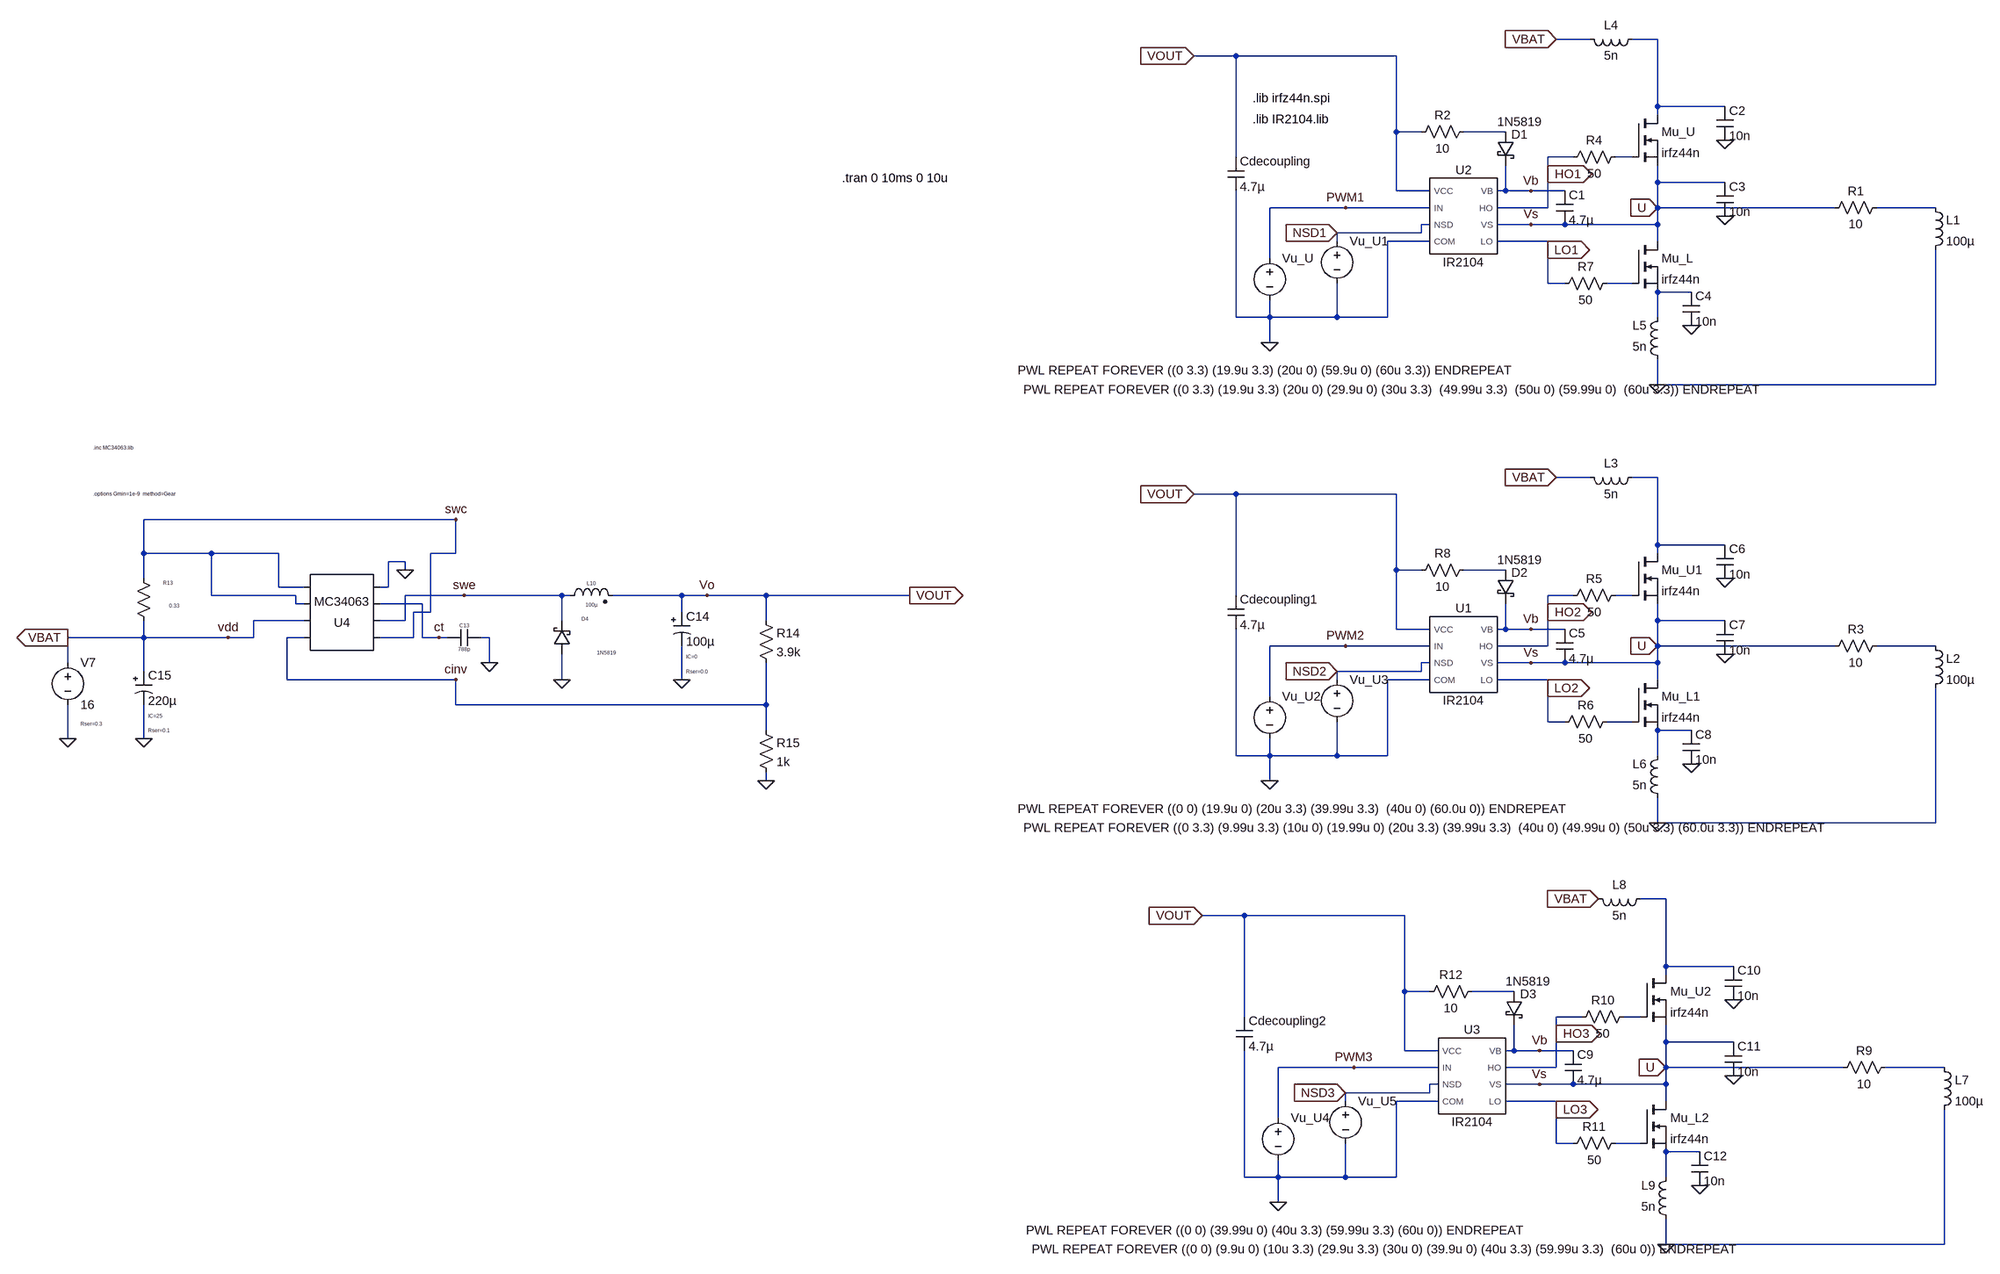
[diagram p0: schematic power_circuitry.asc]
power_circuitry.asc, the LTspice schematic file:
Version 4
SHEET 1 3064 1880
WIRE -336 -480 -400 -480
WIRE -208 -480 -256 -480
WIRE -1008 -448 -1088 -448
WIRE -704 -448 -1008 -448
WIRE -208 -352 -208 -480
WIRE -80 -352 -208 -352
WIRE -208 -336 -208 -352
WIRE -704 -304 -704 -448
WIRE -656 -304 -704 -304
WIRE -496 -304 -576 -304
WIRE -1008 -256 -1008 -448
WIRE -368 -256 -416 -256
WIRE -256 -256 -288 -256
WIRE -416 -224 -416 -256
WIRE -208 -208 -208 -240
WIRE -80 -208 -208 -208
WIRE -704 -192 -704 -304
WIRE -640 -192 -704 -192
WIRE -496 -192 -496 -240
WIRE -496 -192 -512 -192
WIRE -448 -192 -496 -192
WIRE -384 -192 -448 -192
WIRE -800 -160 -944 -160
WIRE -640 -160 -800 -160
WIRE -416 -160 -416 -224
WIRE -416 -160 -512 -160
WIRE -208 -160 -208 -208
WIRE 128 -160 -208 -160
WIRE 320 -160 208 -160
WIRE -640 -128 -656 -128
WIRE -448 -128 -512 -128
WIRE -384 -128 -448 -128
WIRE -208 -128 -208 -160
WIRE -208 -128 -384 -128
WIRE -656 -112 -656 -128
WIRE -656 -112 -816 -112
WIRE -816 -96 -816 -112
WIRE -640 -96 -720 -96
WIRE -416 -96 -512 -96
WIRE -208 -96 -208 -128
WIRE -416 -80 -416 -96
WIRE -944 -64 -944 -160
WIRE -416 -16 -416 -80
WIRE -384 -16 -416 -16
WIRE -256 -16 -304 -16
WIRE -144 0 -208 0
WIRE -1008 48 -1008 -192
WIRE -944 48 -944 16
WIRE -944 48 -1008 48
WIRE -816 48 -816 -16
WIRE -816 48 -944 48
WIRE -720 48 -720 -96
WIRE -720 48 -816 48
WIRE -208 48 -208 0
WIRE -944 96 -944 48
WIRE -208 176 -208 128
WIRE 320 176 320 -80
WIRE 320 176 -208 176
WIRE -336 352 -400 352
WIRE -208 352 -256 352
WIRE -1008 384 -1088 384
WIRE -704 384 -1008 384
WIRE -2720 432 -3312 432
WIRE -208 480 -208 352
WIRE -80 480 -208 480
WIRE -3312 496 -3312 432
WIRE -3184 496 -3312 496
WIRE -3056 496 -3184 496
WIRE -2720 496 -2720 432
WIRE -2720 496 -2768 496
WIRE -208 496 -208 480
WIRE -2816 512 -2848 512
WIRE -2816 528 -2816 512
WIRE -704 528 -704 384
WIRE -656 528 -704 528
WIRE -496 528 -576 528
WIRE -3312 544 -3312 496
WIRE -3056 560 -3056 496
WIRE -3008 560 -3056 560
WIRE -2848 560 -2848 512
WIRE -2848 560 -2864 560
WIRE -3184 576 -3184 496
WIRE -3024 576 -3184 576
WIRE -2704 576 -2816 576
WIRE -2512 576 -2704 576
WIRE -2496 576 -2512 576
WIRE -2256 576 -2416 576
WIRE -2208 576 -2256 576
WIRE -2096 576 -2208 576
WIRE -1824 576 -2096 576
WIRE -1008 576 -1008 384
WIRE -368 576 -416 576
WIRE -256 576 -288 576
WIRE -3024 592 -3024 576
WIRE -3008 592 -3024 592
WIRE -2784 592 -2864 592
WIRE -2768 608 -2768 496
WIRE -2768 608 -2800 608
WIRE -2256 608 -2256 576
WIRE -416 608 -416 576
WIRE -3008 624 -3104 624
WIRE -2816 624 -2816 576
WIRE -2816 624 -2864 624
WIRE -2512 624 -2512 576
WIRE -2096 624 -2096 576
WIRE -208 624 -208 592
WIRE -80 624 -208 624
WIRE -704 640 -704 528
WIRE -640 640 -704 640
WIRE -496 640 -496 592
WIRE -496 640 -512 640
WIRE -448 640 -496 640
WIRE -384 640 -448 640
WIRE -3312 656 -3312 624
WIRE -3312 656 -3456 656
WIRE -3152 656 -3312 656
WIRE -3104 656 -3104 624
WIRE -3104 656 -3152 656
WIRE -3008 656 -3040 656
WIRE -2800 656 -2800 608
WIRE -2800 656 -2864 656
WIRE -2784 656 -2784 592
WIRE -2752 656 -2784 656
WIRE -2736 656 -2752 656
WIRE -2656 656 -2672 656
WIRE -800 672 -944 672
WIRE -640 672 -800 672
WIRE -416 672 -416 608
WIRE -416 672 -512 672
WIRE -208 672 -208 624
WIRE 128 672 -208 672
WIRE 320 672 208 672
WIRE -3456 704 -3456 656
WIRE -2656 704 -2656 656
WIRE -640 704 -656 704
WIRE -448 704 -512 704
WIRE -384 704 -448 704
WIRE -208 704 -208 672
WIRE -208 704 -384 704
WIRE -3312 720 -3312 656
WIRE -656 720 -656 704
WIRE -656 720 -816 720
WIRE -3040 736 -3040 656
WIRE -2720 736 -3040 736
WIRE -2512 736 -2512 688
WIRE -2256 736 -2256 672
WIRE -816 736 -816 720
WIRE -640 736 -720 736
WIRE -416 736 -512 736
WIRE -208 736 -208 704
WIRE -416 752 -416 736
WIRE -944 768 -944 672
WIRE -2720 784 -2720 736
WIRE -2096 784 -2096 704
WIRE -2096 784 -2720 784
WIRE -416 816 -416 752
WIRE -384 816 -416 816
WIRE -256 816 -304 816
WIRE -2096 832 -2096 784
WIRE -144 832 -208 832
WIRE -3456 848 -3456 784
WIRE -3312 848 -3312 784
WIRE -1008 880 -1008 640
WIRE -944 880 -944 848
WIRE -944 880 -1008 880
WIRE -816 880 -816 816
WIRE -816 880 -944 880
WIRE -720 880 -720 736
WIRE -720 880 -816 880
WIRE -208 880 -208 832
WIRE -2096 928 -2096 912
WIRE -944 928 -944 880
WIRE -208 1008 -208 960
WIRE 320 1008 320 752
WIRE 320 1008 -208 1008
WIRE -192 1152 -240 1152
WIRE -992 1184 -1072 1184
WIRE -688 1184 -992 1184
WIRE -192 1280 -192 1152
WIRE -64 1280 -192 1280
WIRE -192 1296 -192 1280
WIRE -688 1328 -688 1184
WIRE -640 1328 -688 1328
WIRE -480 1328 -560 1328
WIRE -992 1376 -992 1184
WIRE -352 1376 -400 1376
WIRE -240 1376 -272 1376
WIRE -400 1408 -400 1376
WIRE -192 1424 -192 1392
WIRE -64 1424 -192 1424
WIRE -688 1440 -688 1328
WIRE -624 1440 -688 1440
WIRE -480 1440 -480 1392
WIRE -480 1440 -496 1440
WIRE -432 1440 -480 1440
WIRE -368 1440 -432 1440
WIRE -784 1472 -928 1472
WIRE -624 1472 -784 1472
WIRE -400 1472 -400 1408
WIRE -400 1472 -496 1472
WIRE -192 1472 -192 1424
WIRE 144 1472 -192 1472
WIRE 336 1472 224 1472
WIRE -624 1504 -640 1504
WIRE -432 1504 -496 1504
WIRE -368 1504 -432 1504
WIRE -192 1504 -192 1472
WIRE -192 1504 -368 1504
WIRE -640 1520 -640 1504
WIRE -640 1520 -800 1520
WIRE -800 1536 -800 1520
WIRE -624 1536 -704 1536
WIRE -400 1536 -496 1536
WIRE -192 1536 -192 1504
WIRE -400 1552 -400 1536
WIRE -928 1568 -928 1472
WIRE -400 1616 -400 1552
WIRE -368 1616 -400 1616
WIRE -240 1616 -288 1616
WIRE -128 1632 -192 1632
WIRE -992 1680 -992 1440
WIRE -928 1680 -928 1648
WIRE -928 1680 -992 1680
WIRE -800 1680 -800 1616
WIRE -800 1680 -928 1680
WIRE -704 1680 -704 1536
WIRE -704 1680 -800 1680
WIRE -192 1680 -192 1632
WIRE -928 1728 -928 1680
WIRE -192 1808 -192 1760
WIRE 336 1808 336 1552
WIRE 336 1808 -192 1808
FLAG -944 96 0
FLAG -208 176 0
FLAG -816 -112 NSD1
IOPIN -816 -112 In
FLAG -448 -128 Vs
FLAG -448 -192 Vb
FLAG -416 -224 HO1
IOPIN -416 -224 Out
FLAG -416 -80 LO1
IOPIN -416 -80 Out
FLAG -208 -160 U
IOPIN -208 -160 In
FLAG -800 -160 PWM1
FLAG -80 -144 0
FLAG -80 -288 0
FLAG -144 64 0
FLAG -944 928 0
FLAG -208 1008 0
FLAG -816 720 NSD2
IOPIN -816 720 In
FLAG -448 704 Vs
FLAG -448 640 Vb
FLAG -416 608 HO2
IOPIN -416 608 Out
FLAG -416 752 LO2
IOPIN -416 752 Out
FLAG -208 672 U
IOPIN -208 672 In
FLAG -800 672 PWM2
FLAG -80 688 0
FLAG -80 544 0
FLAG -144 896 0
FLAG -928 1728 0
FLAG -192 1808 0
FLAG -800 1520 NSD3
IOPIN -800 1520 In
FLAG -432 1504 Vs
FLAG -432 1440 Vb
FLAG -400 1408 HO3
IOPIN -400 1408 Out
FLAG -400 1552 LO3
IOPIN -400 1552 Out
FLAG -192 1472 U
IOPIN -192 1472 In
FLAG -784 1472 PWM3
FLAG -64 1488 0
FLAG -64 1344 0
FLAG -128 1696 0
FLAG -3456 848 0
FLAG -3312 848 0
FLAG -2656 704 0
FLAG -2512 736 0
FLAG -2256 736 0
FLAG -2208 576 Vo
FLAG -2096 928 0
FLAG -2816 528 0
FLAG -2752 656 ct
FLAG -2704 576 swe
FLAG -3152 656 vdd
FLAG -2720 736 cinv
FLAG -2720 432 swc
FLAG -1824 576 VOUT
IOPIN -1824 576 Out
FLAG -1088 -448 VOUT
IOPIN -1088 -448 In
FLAG -1088 384 VOUT
IOPIN -1088 384 In
FLAG -1072 1184 VOUT
IOPIN -1072 1184 In
FLAG -3456 656 VBAT
IOPIN -3456 656 Out
FLAG -400 -480 VBAT
IOPIN -400 -480 In
FLAG -400 352 VBAT
IOPIN -400 352 In
FLAG -320 1152 VBAT
IOPIN -320 1152 In
SYMBOL nmos -256 -96 R0
SYMATTR InstName Mu_L
SYMATTR Value irfz44n
SYMATTR Prefix X
SYMBOL nmos -256 -336 R0
SYMATTR InstName Mu_U
SYMATTR Value irfz44n
SYMATTR Prefix X
SYMBOL voltage -944 -80 R0
WINDOW 3 -478 229 Left 2
SYMATTR Value PWL REPEAT FOREVER ((0 3.3) (19.9u 3.3) (20u 0) (59.9u 0) (60u 3.3)) ENDREPEAT
SYMATTR InstName Vu_U
SYMBOL schottky -512 -304 R0
WINDOW 0 27 5 Left 2
WINDOW 3 0 -19 Left 2
SYMATTR InstName D1
SYMATTR Value 1N5819
SYMATTR Description Diode
SYMATTR Type diode
SYMBOL cap -400 -192 R0
SYMATTR InstName C1
SYMATTR Value 4.7µ
SYMBOL voltage -816 -112 R0
WINDOW 3 -595 297 Left 2
SYMATTR Value PWL REPEAT FOREVER ((0 3.3) (19.9u 3.3) (20u 0) (29.9u 0) (30u 3.3)  (49.99u 3.3)  (50u 0) (59.99u 0)  (60u 3.3)) ENDREPEAT
SYMATTR InstName Vu_U1
SYMBOL res 224 -176 R90
WINDOW 0 0 56 VBottom 2
WINDOW 3 32 56 VTop 2
SYMATTR InstName R1
SYMATTR Value 10
SYMBOL ind 304 -176 R0
SYMATTR InstName L1
SYMATTR Value 100µ
SYMBOL cap -1024 -256 R0
SYMATTR InstName Cdecoupling
SYMATTR Value 4.7µ
SYMBOL AutoGenerated\\IR2104 -576 -144 R0
SYMATTR InstName U2
SYMBOL cap -96 -352 R0
SYMATTR InstName C2
SYMATTR Value 10n
SYMATTR SpiceLine Rser=1
SYMBOL cap -96 -208 R0
SYMATTR InstName C3
SYMATTR Value 10n
SYMATTR SpiceLine Rser=1
SYMBOL cap -160 0 R0
SYMATTR InstName C4
SYMATTR Value 10n
SYMATTR SpiceLine Rser=1
SYMBOL ind -240 -496 R90
WINDOW 0 5 56 VBottom 2
WINDOW 3 32 56 VTop 2
SYMATTR InstName L4
SYMATTR Value 5n
SYMBOL ind -192 144 R180
WINDOW 0 36 80 Left 2
WINDOW 3 36 40 Left 2
SYMATTR InstName L5
SYMATTR Value 5n
SYMBOL res -272 -272 R90
WINDOW 0 0 56 VBottom 2
WINDOW 3 32 56 VTop 2
SYMATTR InstName R4
SYMATTR Value 50
SYMBOL res -288 -32 R90
WINDOW 0 0 56 VBottom 2
WINDOW 3 32 56 VTop 2
SYMATTR InstName R7
SYMATTR Value 50
SYMBOL res -560 -320 R90
WINDOW 0 0 56 VBottom 2
WINDOW 3 32 56 VTop 2
SYMATTR InstName R2
SYMATTR Value 10
SYMBOL nmos -256 736 R0
SYMATTR InstName Mu_L1
SYMATTR Value irfz44n
SYMATTR Prefix X
SYMBOL nmos -256 496 R0
SYMATTR InstName Mu_U1
SYMATTR Value irfz44n
SYMATTR Prefix X
SYMBOL voltage -944 752 R0
WINDOW 3 -478 229 Left 2
SYMATTR Value PWL REPEAT FOREVER ((0 0) (19.9u 0) (20u 3.3) (39.99u 3.3)  (40u 0) (60.0u 0)) ENDREPEAT
SYMATTR InstName Vu_U2
SYMBOL schottky -512 528 R0
WINDOW 0 27 5 Left 2
WINDOW 3 0 -19 Left 2
SYMATTR InstName D2
SYMATTR Value 1N5819
SYMATTR Description Diode
SYMATTR Type diode
SYMBOL cap -400 640 R0
SYMATTR InstName C5
SYMATTR Value 4.7µ
SYMBOL voltage -816 720 R0
WINDOW 3 -595 297 Left 2
SYMATTR Value PWL REPEAT FOREVER ((0 3.3) (9.99u 3.3) (10u 0) (19.99u 0) (20u 3.3) (39.99u 3.3)  (40u 0) (49.99u 0) (50u 3.3) (60.0u 3.3)) ENDREPEAT
SYMATTR InstName Vu_U3
SYMBOL res 224 656 R90
WINDOW 0 0 56 VBottom 2
WINDOW 3 32 56 VTop 2
SYMATTR InstName R3
SYMATTR Value 10
SYMBOL ind 304 656 R0
SYMATTR InstName L2
SYMATTR Value 100µ
SYMBOL cap -1024 576 R0
SYMATTR InstName Cdecoupling1
SYMATTR Value 4.7µ
SYMBOL AutoGenerated\\IR2104 -576 688 R0
SYMATTR InstName U1
SYMBOL cap -96 480 R0
SYMATTR InstName C6
SYMATTR Value 10n
SYMATTR SpiceLine Rser=1
SYMBOL cap -96 624 R0
SYMATTR InstName C7
SYMATTR Value 10n
SYMATTR SpiceLine Rser=1
SYMBOL cap -160 832 R0
SYMATTR InstName C8
SYMATTR Value 10n
SYMATTR SpiceLine Rser=1
SYMBOL ind -240 336 R90
WINDOW 0 5 56 VBottom 2
WINDOW 3 32 56 VTop 2
SYMATTR InstName L3
SYMATTR Value 5n
SYMBOL ind -192 976 R180
WINDOW 0 36 80 Left 2
WINDOW 3 36 40 Left 2
SYMATTR InstName L6
SYMATTR Value 5n
SYMBOL res -272 560 R90
WINDOW 0 0 56 VBottom 2
WINDOW 3 32 56 VTop 2
SYMATTR InstName R5
SYMATTR Value 50
SYMBOL res -288 800 R90
WINDOW 0 0 56 VBottom 2
WINDOW 3 32 56 VTop 2
SYMATTR InstName R6
SYMATTR Value 50
SYMBOL res -560 512 R90
WINDOW 0 0 56 VBottom 2
WINDOW 3 32 56 VTop 2
SYMATTR InstName R8
SYMATTR Value 10
SYMBOL nmos -240 1536 R0
SYMATTR InstName Mu_L2
SYMATTR Value irfz44n
SYMATTR Prefix X
SYMBOL nmos -240 1296 R0
SYMATTR InstName Mu_U2
SYMATTR Value irfz44n
SYMATTR Prefix X
SYMBOL voltage -928 1552 R0
WINDOW 3 -478 229 Left 2
SYMATTR Value PWL REPEAT FOREVER ((0 0) (39.99u 0) (40u 3.3) (59.99u 3.3) (60u 0)) ENDREPEAT
SYMATTR InstName Vu_U4
SYMBOL schottky -496 1328 R0
WINDOW 0 27 5 Left 2
WINDOW 3 0 -19 Left 2
SYMATTR InstName D3
SYMATTR Value 1N5819
SYMATTR Description Diode
SYMATTR Type diode
SYMBOL cap -384 1440 R0
SYMATTR InstName C9
SYMATTR Value 4.7µ
SYMBOL voltage -800 1520 R0
WINDOW 3 -595 297 Left 2
SYMATTR Value PWL REPEAT FOREVER ((0 0) (9.9u 0) (10u 3.3) (29.9u 3.3) (30u 0) (39.9u 0) (40u 3.3) (59.99u 3.3)  (60u 0)) ENDREPEAT
SYMATTR InstName Vu_U5
SYMBOL res 240 1456 R90
WINDOW 0 0 56 VBottom 2
WINDOW 3 32 56 VTop 2
SYMATTR InstName R9
SYMATTR Value 10
SYMBOL ind 320 1456 R0
SYMATTR InstName L7
SYMATTR Value 100µ
SYMBOL cap -1008 1376 R0
SYMATTR InstName Cdecoupling2
SYMATTR Value 4.7µ
SYMBOL AutoGenerated\\IR2104 -560 1488 R0
SYMATTR InstName U3
SYMBOL cap -80 1280 R0
SYMATTR InstName C10
SYMATTR Value 10n
SYMATTR SpiceLine Rser=1
SYMBOL cap -80 1424 R0
SYMATTR InstName C11
SYMATTR Value 10n
SYMATTR SpiceLine Rser=1
SYMBOL cap -144 1632 R0
SYMATTR InstName C12
SYMATTR Value 10n
SYMATTR SpiceLine Rser=1
SYMBOL ind -224 1136 R90
WINDOW 0 5 56 VBottom 2
WINDOW 3 32 56 VTop 2
SYMATTR InstName L8
SYMATTR Value 5n
SYMBOL ind -176 1776 R180
WINDOW 0 36 80 Left 2
WINDOW 3 36 40 Left 2
SYMATTR InstName L9
SYMATTR Value 5n
SYMBOL res -256 1360 R90
WINDOW 0 0 56 VBottom 2
WINDOW 3 32 56 VTop 2
SYMATTR InstName R10
SYMATTR Value 50
SYMBOL res -272 1600 R90
WINDOW 0 0 56 VBottom 2
WINDOW 3 32 56 VTop 2
SYMATTR InstName R11
SYMATTR Value 50
SYMBOL res -544 1312 R90
WINDOW 0 0 56 VBottom 2
WINDOW 3 32 56 VTop 2
SYMATTR InstName R12
SYMATTR Value 10
SYMBOL voltage -3456 688 R0
WINDOW 123 0 0 Left 0
WINDOW 39 24 132 Left 0
SYMATTR SpiceLine Rser=0.3
SYMATTR InstName V7
SYMATTR Value 16
SYMBOL res -3296 640 R180
WINDOW 0 -39 87 Left 0
WINDOW 3 -52 44 Left 0
SYMATTR InstName R13
SYMATTR Value 0.33
SYMBOL cap -2736 672 R270
WINDOW 0 32 32 VTop 0
WINDOW 3 0 32 VBottom 0
SYMATTR InstName C13
SYMATTR Value 788p
SYMBOL schottky -2496 688 R180
WINDOW 0 -34 67 Left 0
WINDOW 3 -86 3 Left 0
SYMATTR InstName D4
SYMATTR Value 1N5819
SYMATTR Description Diode
SYMATTR Type diode
SYMBOL res -2112 608 R0
SYMATTR InstName R14
SYMATTR Value 3.9k
SYMBOL res -2112 816 R0
SYMATTR InstName R15
SYMATTR Value 1k
SYMBOL polcap -2272 608 R0
WINDOW 39 24 113 Left 0
WINDOW 40 24 85 Left 0
SYMATTR SpiceLine Rser=0.0
SYMATTR SpiceLine2 IC=0
SYMATTR InstName C14
SYMATTR Value 100µ
SYMBOL polcap -3328 720 R0
WINDOW 39 24 113 Left 0
WINDOW 40 24 85 Left 0
SYMATTR SpiceLine Rser=0.1
SYMATTR SpiceLine2 IC=25
SYMATTR InstName C15
SYMATTR Value 220µ
SYMBOL AutoGenerated\\MC34063 -2928 608 R180
SYMATTR InstName U4
SYMBOL ind2 -2512 592 R270
WINDOW 0 32 56 VTop 0
WINDOW 3 4 56 VBottom 0
SYMATTR InstName L10
SYMATTR Value 100µ
SYMATTR SpiceLine Rser=0
SYMATTR Type ind
TEXT -1952 -216 Left 2 !.tran 0 10ms 0 10u
TEXT -976 -368 Left 2 !.lib irfz44n.spi
TEXT -976 -328 Left 2 !.lib IR2104.lib
TEXT -3408 296 Left 0 !.inc MC34063.lib
TEXT -3408 384 Left 0 !.options Gmin=1e-9  method=Gear

The netlist it stands for:
* power_circuitry.asc
XMu_L U N005 N006 irfz44n  ; pins D G S
XMu_U N001 N003 U irfz44n  ; pins D G S
Vu_U PWM1 0 PWL REPEAT FOREVER ((0 3.3) (19.9u 3.3) (20u 0) (59.9u 0) (60u 3.3)) ENDREPEAT
D1 N002 Vb 1N5819
C1 Vb U 4.7µ
Vu_U1 NSD1 0 PWL REPEAT FOREVER ((0 3.3) (19.9u 3.3) (20u 0) (29.9u 0) (30u 3.3)  (49.99u 3.3)  (50u 0) (59.99u 0)  (60u 3.3)) ENDREPEAT
R1 N004 U 10
L1 N004 0 100µ
Cdecoupling VOUT 0 4.7µ
XU2 LO1 HO1 0 PWM1 VOUT Vb U NSD1 IR2104  ; pins LO HO COM IN VCC VB VS NSD
C2 N001 0 10n Rser=1
C3 U 0 10n Rser=1
C4 N006 0 10n Rser=1
L4 N001 VBAT 5n
L5 0 N006 5n
R4 N003 HO1 50
R7 N005 LO1 50
R2 N002 VOUT 10
XMu_L1 U N011 N012 irfz44n  ; pins D G S
XMu_U1 N007 N009 U irfz44n  ; pins D G S
Vu_U2 PWM2 0 PWL REPEAT FOREVER ((0 0) (19.9u 0) (20u 3.3) (39.99u 3.3)  (40u 0) (60.0u 0)) ENDREPEAT
D2 N008 Vb 1N5819
C5 Vb U 4.7µ
Vu_U3 NSD2 0 PWL REPEAT FOREVER ((0 3.3) (9.99u 3.3) (10u 0) (19.99u 0) (20u 3.3) (39.99u 3.3)  (40u 0) (49.99u 0) (50u 3.3) (60.0u 3.3)) ENDREPEAT
R3 N010 U 10
L2 N010 0 100µ
Cdecoupling1 VOUT 0 4.7µ
XU1 LO2 HO2 0 PWM2 VOUT Vb U NSD2 IR2104  ; pins LO HO COM IN VCC VB VS NSD
C6 N007 0 10n Rser=1
C7 U 0 10n Rser=1
C8 N012 0 10n Rser=1
L3 N007 VBAT 5n
L6 0 N012 5n
R5 N009 HO2 50
R6 N011 LO2 50
R8 N008 VOUT 10
XMu_L2 U N017 N018 irfz44n  ; pins D G S
XMu_U2 N013 N015 U irfz44n  ; pins D G S
Vu_U4 PWM3 0 PWL REPEAT FOREVER ((0 0) (39.99u 0) (40u 3.3) (59.99u 3.3) (60u 0)) ENDREPEAT
D3 N014 Vb 1N5819
C9 Vb U 4.7µ
Vu_U5 NSD3 0 PWL REPEAT FOREVER ((0 0) (9.9u 0) (10u 3.3) (29.9u 3.3) (30u 0) (39.9u 0) (40u 3.3) (59.99u 3.3)  (60u 0)) ENDREPEAT
R9 N016 U 10
L7 N016 0 100µ
Cdecoupling2 VOUT 0 4.7µ
XU3 LO3 HO3 0 PWM3 VOUT Vb U NSD3 IR2104  ; pins LO HO COM IN VCC VB VS NSD
C10 N013 0 10n Rser=1
C11 U 0 10n Rser=1
C12 N018 0 10n Rser=1
L8 N013 VBAT 5n
L9 0 N018 5n
R10 N015 HO3 50
R11 N017 LO3 50
R12 N014 VOUT 10
V7 VBAT 0 16 Rser=0.3
R13 VBAT swc 0.33
C13 ct 0 788p
D4 0 swe 1N5819
R14 VOUT cinv 3.9k
R15 cinv 0 1k
C14 VOUT 0 100µ Rser=0.0 IC=0
C15 VBAT 0 220µ Rser=0.1 IC=25
* U4: MC34063 (symbol AutoGenerated\MC34063 not available, pins judged from their places): pin1=swc pin2=swe pin3=ct pin4=0 pin5=cinv pin6=VBAT pin7=swc pin8=swc
L10 swe VOUT 100µ Rser=0
.model D D
.lib standard.dio
.tran 0 10ms 0 10u
.lib irfz44n.spi
.lib IR2104.lib
.inc MC34063.lib
.options Gmin=1e-9  method=Gear
.lib C:\users\iwolfs\My Documents\LTspiceXVII\lib\other\IR2104\Model\IR2104.lib
.backanno
.end